# Altium schematic sheet driver.SchDoc
size A4
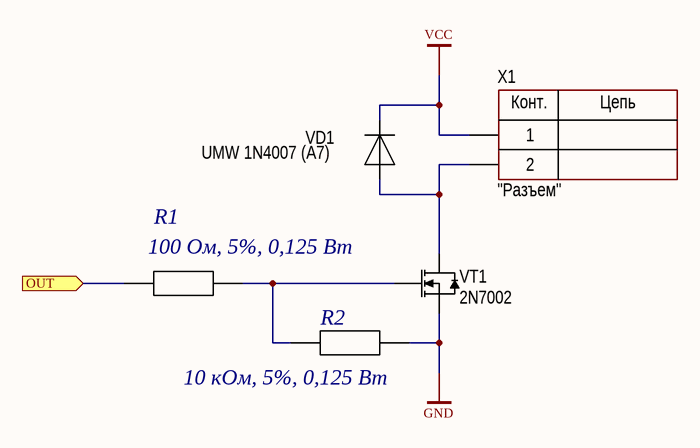
[diagram p0: driver.SchDoc]

## Parts
R1  100 Ом, 5%, 0,125 Вт  [RES: 0805]
R2  10 кОм, 5%, 0,125 Вт  [RES: 0805]
VD1  PartNumber: UMW 1N4007 (A7)  [DIODE: SOD123FL]
VT1  PartNumber: 2N7002  [SOT23]
X1  CommentText: "Разъем"  [TB_2_2.5MM]

## Ports
OUT (in)

## Nets
GND: R2.2 VT1.2(S)
VCC: VD1.2 X1.1
OUT: R1.1 ; port OUT
NetR1_2: R1.2 R2.1 VT1.1(G)
NetVD1_1: VD1.1 VT1.3(D) X1.2

## Notes on the sheet
- (in symbol DG308-2.54-02P-14-00A(H)) Конт.; Цепь

## Library data of the parts
R1 = RC0805JR-07100RL: Бескорпусные толстопленочные резисторы (чип-резисторы, smd-резисторы) предназначены для работы в цепях постоянного, переменного и импульсного тока. Используются для поверхностного монтажа.; Manufacturer: Тайвань; Value: 100; Power: 0,25; ID: 35; ElementName: 0.125Вт 0805 100 Ом, 5%, Чип резистор (SMD); ChipDip: #https://www.chipdip.ru/product0/481795709#; MaxVoltage: 150 В; ValueSCH: 100 Ом, 5%, 0,125 Вт; Partnumber: RC0805JR-07100RL; Package: 0805; Price: 2*20; Last_update: 20.11.2020
R2 = RC0805JR-0710KL: Бескорпусные толстопленочные резисторы (чип-резисторы, smd-резисторы) предназначены для работы в цепях постоянного, переменного и импульсного тока. Используются для поверхностного монтажа.; Manufacturer: Тайвань; Value: 100; Power: 0,25; ID: 32; ElementName: 0.125Вт 0805 10 кОм, 5%, Чип резистор (SMD); ChipDip: #https://www.chipdip.ru/product0/528580584#; MaxVoltage: 150 В; ValueSCH: 10 кОм, 5%, 0,125 Вт; Partnumber: RC0805JR-0710KL; Package: 0805; Price: 2; Last_update: 20.11.2020
VD1 = UMW 1N4007 (A7): Manufacturer: UMW (Youtai Semiconductor Co., Ltd.); ValueManufacturerPartNumber: Single diode, 75V, 150mA, 1V, 4ns, SOD-123FL, -55...+150°C; TypeDiode: Single diode; Voltage: 75V; Current: 150mA; VoltageDrop: 1V; RecoveryTime: 4ns; ID: 2; ElementName: Диод 1А 1000В, 1N4007 (A7); ChipDip: #https://www.chipdip.ru/product/1n4007-a7#; MaxVoltage: 1000; Package: SOD-123FL; HelpURL: https://www.digikey.com/product-detail/en/micro-commercial-co/1N4148WX-TP/1N4148WXTPMSCT-ND/717312; Temperature: -55...+150°C; ValueSCH: 1N4007 (A7); Price: 2; Last_update: 12.10.2023
VT1 = 2N7002: MOSFETS-транзистор; Manufacturer: Jiangsu Changjiang Electronics Technology Co., Ltd; ValueManufacturerPartNumber: MOSFET N-channel transistor, 80V, 7A, 9.1nC, 2.5W, 34mOhm, 756pF, 8-TDSON, -55...+150°C; TypeTransistor: MOSFET N-channel transistor; VoltageDS: 80V; CurrentDS: 7A; RDS: 34mOhm; GateCharge: 9.1nC; InputCapacitor: 756pF; MaxPower: 2.5W; ID: 4; ElementName: Транзистор, N-канал, 60В, 0.2А; Package: 8-TDSON; HelpURL: https://www.digikey.com/product-detail/en/infineon-technologies/BSC340N08NS3GATMA1/BSC340N08NS3GATMA1TR-ND/2080655; Temperature: -55...+150°C; URL_bying: https://www.chipdip.ru/product/2n7002-jcet; weight: 0,05; price: 5; ValueSCH: 2N7002
X1 = DG308-2.54-02P-14-00A(H): Винтовой клеммный блок c рельефной обоймой, 2 контакта. Серия DG308-2.54; Manufacturer: Китай; ValueManufacturerPartNumber: Terminal connector, 2pin, 3.5mm, 300VAC, 10A; TypeConnector: Terminal connector; VoltageMax: 300VAC; Pitch: 3.5mm; CurrentMax: 10A; Multichannel: 2pin; ID: 6; ElementName: 308-021-14, Клеммник винтовой, 2-контактный, 2.54мм, прямой; ValueSCH: Клемник 308-021-14; ChipDip: #https://www.chipdip.ru/product/308-021-12-14#; HelpURL: https://www.chipdip.ru/product/dg350-3.5-02p-12; PartNumber: DG308-2.54-02P-14-00A(H); Price: 19 ₽; Last_update: 23.11.2020